# Altium schematic sheet Sheet1.SchDoc
size A3
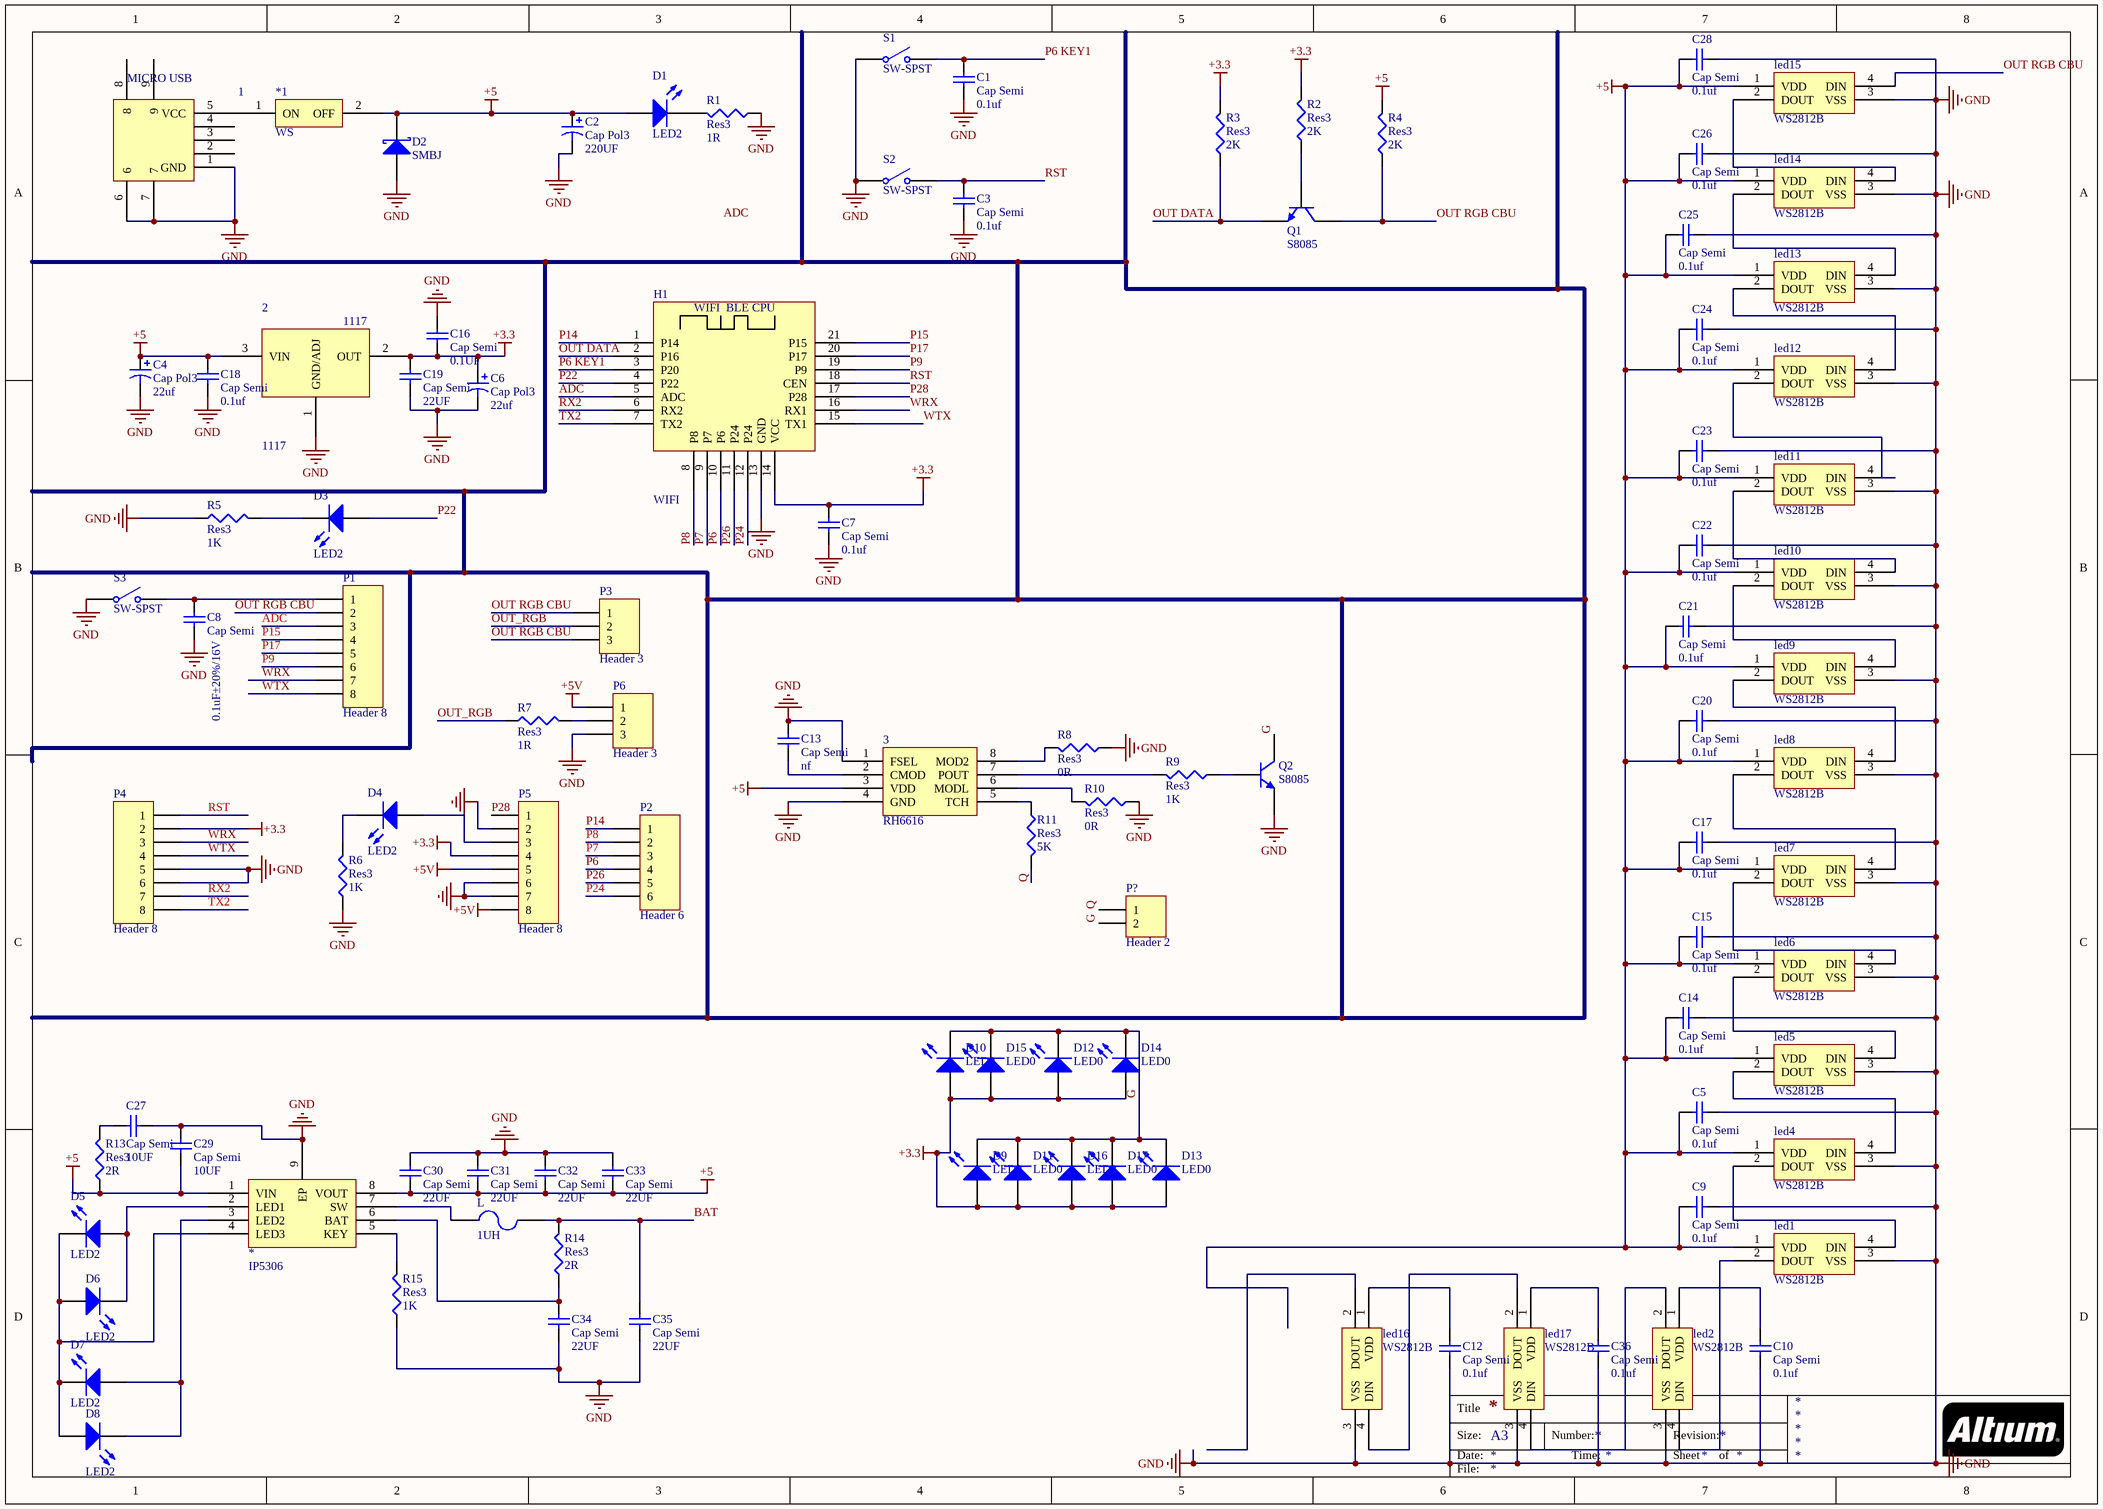
[diagram p0: Sheet1.SchDoc]

## Parts
1  MICRO USB  [USB]
2  1117  [1117]
3  RH6616  [RH6616]
*  IP5306  [IP5306]
*1  WS  [SW-SMD_SSSS212301]
C1  Cap Semi  value 0.1uf  [C1206]
C2  Cap Pol3  value 220UF  [C0805]
C3  Cap Semi  value 0.1uf  [C1206]
C4  Cap Pol3  value 22uf  [C0805]
C5  Cap Semi  value 0.1uf  [C1206]
C6  Cap Pol3  value 22uf  [C0805]
C7  Cap Semi  value 0.1uf  [C1206]
C8  Cap Semi  value 0.1uF±20%/16V  [C1206]
C9  Cap Semi  value 0.1uf  [C1206]
C10  Cap Semi  value 0.1uf  [C1206]
C12  Cap Semi  value 0.1uf  [C1206]
C13  Cap Semi  value nf  [C1206]
C14  Cap Semi  value 0.1uf  [C1206]
C15  Cap Semi  value 0.1uf  [C1206]
C16  Cap Semi  value 0.1UF  [C1206]
C17  Cap Semi  value 0.1uf  [C1206]
C18  Cap Semi  value 0.1uf  [C1206]
C19  Cap Semi  value 22UF  [C1206]
C20  Cap Semi  value 0.1uf  [C1206]
C21  Cap Semi  value 0.1uf  [C1206]
C22  Cap Semi  value 0.1uf  [C1206]
C23  Cap Semi  value 0.1uf  [C1206]
C24  Cap Semi  value 0.1uf  [C1206]
C25  Cap Semi  value 0.1uf  [C1206]
C26  Cap Semi  value 0.1uf  [C1206]
C27  Cap Semi  value 10UF  [C1206]
C28  Cap Semi  value 0.1uf  [C1206]
C29  Cap Semi  value 10UF  [C1206]
C30  Cap Semi  value 22UF  [C1206]
C31  Cap Semi  value 22UF  [C1206]
C32  Cap Semi  value 22UF  [C1206]
C33  Cap Semi  value 22UF  [C1206]
C34  Cap Semi  value 22UF  [C1206]
C35  Cap Semi  value 22UF  [C1206]
C36  Cap Semi  value 0.1uf  [C1206]
D1  LED2  [3.2X1.6X1.1]
D2  SMBJ  [SMB]
D3  LED2  [3.2X1.6X1.1]
D4  LED2  [3.2X1.6X1.1]
D5  LED2  [灯]
D6  LED2  [灯]
D7  LED2  [灯]
D8  LED2  [灯]
D9  LED0  [陶瓷灯丝]
D10  LED0  [陶瓷灯丝]
D11  LED0  [陶瓷灯丝]
D12  LED0  [陶瓷灯丝]
D13  LED0  [陶瓷灯丝]
D14  LED0  [陶瓷灯丝]
D15  LED0  [陶瓷灯丝]
D16  LED0  [陶瓷灯丝]
D17  LED0  [陶瓷灯丝]
H1  WIFI  [WIFI]
L  1UH  [PCBComponent_1 - duplicate1]
led1  WS2812B  [WS2812]
led2  WS2812B  [WS2812]
led4  WS2812B  [WS2812]
led5  WS2812B  [WS2812]
led6  WS2812B  [WS2812]
led7  WS2812B  [WS2812]
led8  WS2812B  [WS2812]
led9  WS2812B  [WS2812]
led10  WS2812B  [WS2812]
led11  WS2812B  [WS2812]
led12  WS2812B  [WS2812]
led13  WS2812B  [WS2812]
led14  WS2812B  [WS2812]
led15  WS2812B  [WS2812]
led16  WS2812B  [WS2812]
led17  WS2812B  [WS2812]
P1  Header 8  [HDR1X8]
P2  Header 6  [HDR1X6]
P3  Header 3  [HDR1X3]
P4  Header 8  [HDR1X8]
P5  Header 8  [HDR1X8]
P6  Header 3  [HDR1X3]
P?  Header 2  [HDR1X2]
Q1  S8085  [SOT-23B_N]
Q2  S8085  [SOT-23B_N]
R1  Res3  value 1R  [J1-0603]
R2  Res3  value 2K  [J1-0603]
R3  Res3  value 2K  [J1-0603]
R4  Res3  value 2K  [J1-0603]
R5  Res3  value 1K  [J1-0603]
R6  Res3  value 1K  [J1-0603]
R7  Res3  value 1R  [J1-0603]
R8  Res3  value 0R  [J1-0603]
R9  Res3  value 1K  [J1-0603]
R10  Res3  value 0R  [J1-0603]
R11  Res3  value 5K  [J1-0603]
R13  Res3  value 2R  [J1-0603]
R14  Res3  value 2R  [J1-0603]
R15  Res3  value 1K  [J1-0603]
S1  SW-SPST  [sw]
S2  SW-SPST  [sw]
S3  SW-SPST  [sw]

## Nets
+3.3: 2.2(OUT) C6.1 C7.1 C16.2 C19.2 D9.1(A) D10.1(A) D11.1(A) D12.1(A) D13.1(A) D14.1(A) D15.1(A) D16.1(A) D17.1(A) H1.14(VCC) P4.2 P5.4 R2.2 R3.2
+5: 2.3(VIN) 3.3(VDD) *.1(VIN) *.8(VOUT) *1.2(OFF) C2.1 C4.1 C5.1 C9.1 C14.1 C15.1 C17.1 C18.1 C20.1 C21.1 C22.1 C23.1 C24.1 C25.1 C26.1 C28.1 C29.1 C30.1 C31.1 C32.1 C33.1 D1.1(A) D2.2(K) led1.1(VDD) led4.1(VDD) led5.1(VDD) led6.1(VDD) led7.1(VDD) led8.1(VDD) led9.1(VDD) led10.1(VDD) led11.1(VDD) led12.1(VDD) led13.1(VDD) led14.1(VDD) led15.1(VDD) R4.2 R13.1
+5V: P5.5 P5.8 P6.1
GND: 1.1(GND) 1.6 1.7 2.1(GND/ADJ) 3.1(FSEL) 3.4(GND) *.9(EP) C1.1 C2.2 C3.1 C4.2 C5.2 C6.2 C7.2 C8.1 C9.2 C10.1 C12.1 C13.2 C14.2 C15.2 C16.1 C17.2 C18.2 C19.1 C20.2 C21.2 C22.2 C23.2 C24.2 C25.2 C26.2 C27.2 C28.2 C29.2 C30.2 C31.2 C32.2 C33.2 C34.1 C35.1 C36.1 D2.1(A) H1.13(GND) led1.3(VSS) led2.3(VSS) led4.3(VSS) led5.3(VSS) led6.3(VSS) led7.3(VSS) led8.3(VSS) led9.3(VSS) led10.3(VSS) led11.3(VSS) led12.3(VSS) led13.3(VSS) led14.3(VSS) led15.3(VSS) led16.3(VSS) led17.3(VSS) P4.5 P4.6 P5.2 P5.6 P5.7 P6.3 Q2.3(E) R1.1 R5.1 R6.1 R8.1 R10.1 R15.1 S1.1(COMMON) S2.1(COMMON) S3.1(COMMON)
ADC: H1.5(ADC) P1.3
BAT: C35.2 L.2 R14.2
G: D9.2(K) D10.2(K) D11.2(K) D12.2(K) D13.2(K) D14.2(K) D15.2(K) D16.2(K) D17.2(K) P?.2 Q2.1(C)
OUT DATA: H1.2(P16) Q1.3(E) R3.1
OUT RGB CBU: led15.4(DIN) P1.2 P3.1 P3.3 Q1.1(C) R4.1
OUT_RGB: P3.2 R7.1
P6: H1.10(P6) P2.4
P6 KEY1: C1.2 H1.3(P20) S1.2(NO)
P7: H1.9(P7) P2.3
P8: H1.8(P8) P2.2
P9: H1.19(P9) P1.6
P14: H1.1(P14) P2.1
P15: H1.21(P15) P1.4
P17: H1.20(P17) P1.5
P22: D3.1(A) H1.4(P22)
P24: H1.12(P24) P2.6
P26: H1.11(P24) P2.5
P28: H1.17(P28) P5.1
Q: P?.1 R11.2
RST: C3.2 H1.18(CEN) P4.1 S2.2(NO)
RX2: H1.6(RX2) P4.7
TX2: H1.7(TX2) P4.8
WRX: H1.16(RX1) P1.7 P4.3
WTX: H1.15(TX1) P1.8 P4.4
Net1_5: 1.5(VCC) *1.1(ON)
Net3_2: 3.2(CMOD) C13.1
Net3_5: 3.5(TCH) R11.1
Net3_6: 3.6(MODL) R10.2
Net3_7: 3.7(POUT) R9.2
Net3_8: 3.8(MOD2) R8.2
Net*_2: *.2(LED1) D5.1(A) D6.2(K)
Net*_3: *.3(LED2) D7.1(A) D8.2(K)
Net*_4: *.4(LED3) D5.2(K) D6.1(A) D7.2(K) D8.1(A)
Net*_5: *.5(KEY) R15.2
Net*_6: *.6(BAT) C34.2 R14.1
Net*_7: *.7(SW) L.1
NetC8_2: C8.2 P1.1 S3.2(NO)
NetC10_2: C10.2 led2.1(VDD)
NetC12_2: C12.2 led16.1(VDD)
NetC27_1: C27.1 R13.2
NetC36_2: C36.2 led17.1(VDD)
NetD1_2: D1.2(K) R1.2
NetD3_2: D3.2(K) R5.2
NetD4_1: D4.1(A) P5.3
NetD4_2: D4.2(K) R6.2
Netled1_2: led1.2(DOUT) led2.4(DIN)
Netled1_4: led1.4(DIN) led4.2(DOUT)
Netled2_2: led2.2(DOUT) led17.4(DIN)
Netled4_4: led4.4(DIN) led5.2(DOUT)
Netled5_4: led5.4(DIN) led6.2(DOUT)
Netled6_4: led6.4(DIN) led7.2(DOUT)
Netled7_4: led7.4(DIN) led8.2(DOUT)
Netled8_4: led8.4(DIN) led9.2(DOUT)
Netled9_4: led9.4(DIN) led10.2(DOUT)
Netled10_4: led10.4(DIN) led11.2(DOUT)
Netled11_4: led11.4(DIN) led12.2(DOUT)
Netled12_4: led12.4(DIN) led13.2(DOUT)
Netled13_4: led13.4(DIN) led14.2(DOUT)
Netled14_4: led14.4(DIN) led15.2(DOUT)
Netled16_4: led16.4(DIN) led17.2(DOUT)
NetP6_2: P6.2 R7.2
NetQ1_2: Q1.2(B) R2.1
NetQ2_2: Q2.2(B) R9.1

Not connected (* = marked no-connect by the designer): 1 2 3 4 8 9; led16 2(DOUT)

## Notes on the sheet
- Labels drawn without touching a wire or pin: ADC
- Title
- Size:
- Date:
- A3
- Number:
- Time:
- Revision:
- Sheet
- of
- File:
- (in symbol WIFI) WIFI  BLE CPU

## Library data of the parts
C1 C3 C5 C7-C10 C12-C36 = Cap Semi: Capacitor (Semiconductor SIM Model); Published: 8-Jun-2000; LatestRevisionDate: 29-May-2009; LatestRevisionNote: IPC-7351 Footprint Added.; PackageReference: C1206; Publisher: Altium Limited; PackageDescription: Chip Capacitor
C2 C4 C6 = Cap Pol3: Polarized Capacitor (Surface Mount); Published: 8-Jun-2000; LatestRevisionDate: 29-May-2009; LatestRevisionNote: IPC-7351 Footprint Added.; PackageReference: C0805; Publisher: Altium Limited; PackageDescription: Chip Capacitor
D1 D3-D8 = LED2: Typical RED, GREEN, YELLOW, AMBER GaAs LED; Published: 8-Jun-2000; LatestRevisionDate: 17-Jul-2002; LatestRevisionNote: Re-released for DXP Platform.; PackageVersion: Feb-2002; PackageReference: 3.2X1.6X1.1; Publisher: Altium Limited; PackageDescription: SM LED; 2 Flat Leads
D2 = D Schottky: Schottky Diode; Published: 8-Jun-2000; LatestRevisionDate: 17-Jul-2002; LatestRevisionNote: Re-released for DXP Platform.; PackageReference: SMB; Publisher: Altium Limited; PackageDescription: DO-214-AA/SMB; 2 C-Bend Leads; Body 5.3 x 3.6 mm, inc. leads (LxW); Code_JEDEC: DO-214-AA
D9-D17 = LED0: Typical INFRARED GaAs LED; Published: 8-Jun-2000; LatestRevisionDate: 08-Jul-2005; LatestRevisionNote: Mech Layer 1 removed.; PackageReference: LED-0; Publisher: Altium Limited; PackageDescription: LED; 2 Leads
L = Fuse 2: Fuse; Published: 8-Jun-2000; LatestRevisionDate: 17-Jul-2002; LatestRevisionNote: Re-released for DXP Platform.; PackageReference: PIN-W2/E2.8; Publisher: Altium Limited; PackageDescription: Thru-Hole; 2 Leads
P1 P4 P5 = Header 8: Header, 8-Pin; LatestRevisionDate: 17-Jul-2002; LatestRevisionNote: Re-released for DXP Platform.; Publisher: Altium Limited
P2 = Header 6: Header, 6-Pin; LatestRevisionDate: 17-Jul-2002; LatestRevisionNote: Re-released for DXP Platform.; Publisher: Altium Limited
P3 P6 = Header 3: Header, 3-Pin; LatestRevisionDate: 17-Jul-2002; LatestRevisionNote: Re-released for DXP Platform.; Publisher: Altium Limited
P? = Header 2: Header, 2-Pin; LatestRevisionDate: 17-Jul-2002; LatestRevisionNote: Re-released for DXP Platform.; Publisher: Altium Limited
Q1 Q2 = QNPN: NPN Bipolar Transistor; Published: 8-Jun-2000; LatestRevisionDate: 29-May-2009; LatestRevisionNote: IPC-7351 Footprint Added.; PackageVersion: Aug-1999; PackageReference: SOT-23B; Publisher: Altium Limited; PackageDescription: 3-Pin SOT-23 Package 0.95 mm Pitch, 2.4 mm Lead Span
R1-R11 R13-R15 = Res3: Resistor; Published: 8-Jun-2000; LatestRevisionDate: 29-May-2009; LatestRevisionNote: IPC-7351 Footprint Added.; PackageReference: J1-0603; Publisher: Altium Limited; PackageDescription: Chip Resistor
S1-S3 = SW-SPST: Single-Pole, Single-Throw Switch; Published: 24-Mar-1999; LatestRevisionDate: 17-Jul-2002; LatestRevisionNote: Re-released for DXP Platform.; PackageReference: SPST-2; Publisher: Altium Limited; PackageDescription: Switch; 2 Leads